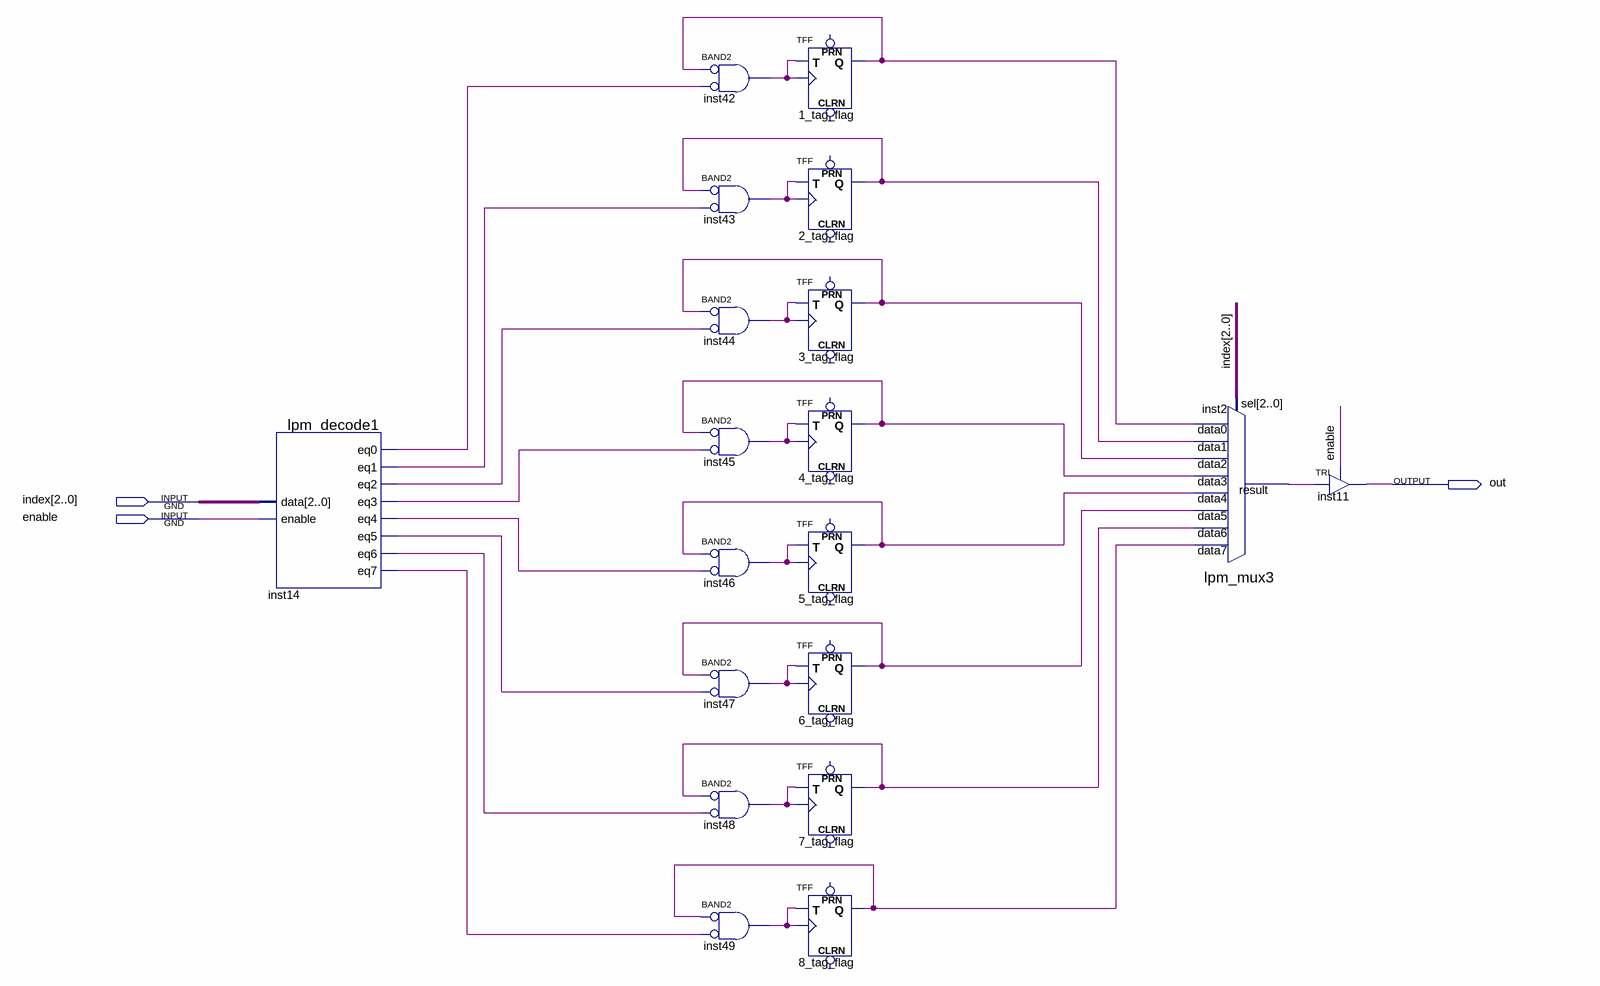
[diagram p0: schematic sheet]
// Quartus schematic tag_flags.bdf as structural Verilog: 19 symbols, 3 pins
module tag_flags (
  input  [2:0] index,
  input  enable,
  output out
);

  wire inst2_result, inst14_eq0, inst14_eq1, inst14_eq2, inst14_eq3, inst14_eq4, inst14_eq5, inst14_eq6,
       inst14_eq7, inst42_out, inst43_out, inst44_out, inst45_out, inst46_out, inst47_out, inst48_out,
       inst49_out, n1_tag_flag_q, n2_tag_flag_q, n3_tag_flag_q, n4_tag_flag_q, n5_tag_flag_q, n6_tag_flag_q,
       n7_tag_flag_q, n8_tag_flag_q;

  lpm_decode1 inst14 (
    .data(index), .enable(enable), .eq0(inst14_eq0), .eq1(inst14_eq1), .eq2(inst14_eq2), .eq3(inst14_eq3),
    .eq4(inst14_eq4), .eq5(inst14_eq5), .eq6(inst14_eq6), .eq7(inst14_eq7));
  and inst42 (inst42_out, ~n1_tag_flag_q, ~inst14_eq0);  // BAND2
  and inst43 (inst43_out, ~n2_tag_flag_q, ~inst14_eq1);  // BAND2
  and inst44 (inst44_out, ~n3_tag_flag_q, ~inst14_eq2);  // BAND2
  and inst45 (inst45_out, ~n4_tag_flag_q, ~inst14_eq3);  // BAND2
  and inst46 (inst46_out, ~n5_tag_flag_q, ~inst14_eq4);  // BAND2
  and inst47 (inst47_out, ~n6_tag_flag_q, ~inst14_eq5);  // BAND2
  and inst48 (inst48_out, ~n7_tag_flag_q, ~inst14_eq6);  // BAND2
  and inst49 (inst49_out, ~n8_tag_flag_q, ~inst14_eq7);  // BAND2
  TFF u_1_tag_flag (.T(inst42_out), .CLK(inst42_out), .Q(n1_tag_flag_q));  // open: PRN, CLRN
  TFF u_2_tag_flag (.T(inst43_out), .CLK(inst43_out), .Q(n2_tag_flag_q));  // open: PRN, CLRN
  TFF u_3_tag_flag (.T(inst44_out), .CLK(inst44_out), .Q(n3_tag_flag_q));  // open: PRN, CLRN
  TFF u_4_tag_flag (.T(inst45_out), .CLK(inst45_out), .Q(n4_tag_flag_q));  // open: PRN, CLRN
  TFF u_5_tag_flag (.T(inst46_out), .CLK(inst46_out), .Q(n5_tag_flag_q));  // open: PRN, CLRN
  TFF u_6_tag_flag (.T(inst47_out), .CLK(inst47_out), .Q(n6_tag_flag_q));  // open: PRN, CLRN
  TFF u_7_tag_flag (.T(inst48_out), .CLK(inst48_out), .Q(n7_tag_flag_q));  // open: PRN, CLRN
  TFF u_8_tag_flag (.T(inst49_out), .CLK(inst49_out), .Q(n8_tag_flag_q));  // open: PRN, CLRN
  lpm_mux3 inst2 (
    .data7(n8_tag_flag_q), .data6(n7_tag_flag_q), .data5(n6_tag_flag_q), .data4(n5_tag_flag_q),
    .data3(n4_tag_flag_q), .data2(n3_tag_flag_q), .data1(n2_tag_flag_q), .data0(n1_tag_flag_q), .sel(index),
    .result(inst2_result));
  TRI inst11 (.IN(inst2_result), .OE(enable), .OUT(out));
endmodule
